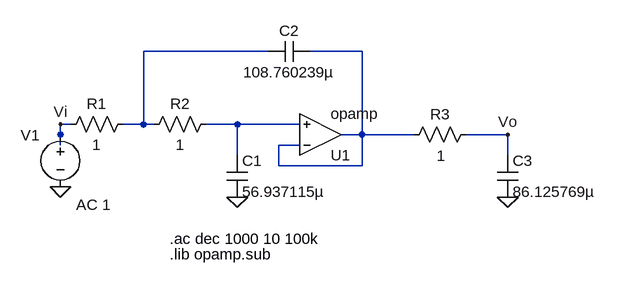
[diagram p0: schematic circuito simulación desnormalizado.asc]
circuito simulación desnormalizado.asc, the LTspice schematic file:
Version 4
SHEET 1 880 680
WIRE 160 16 -32 16
WIRE 304 16 224 16
WIRE -144 128 -160 128
WIRE -32 128 -32 16
WIRE -32 128 -64 128
WIRE -16 128 -32 128
WIRE 112 128 64 128
WIRE 208 128 112 128
WIRE -160 144 -160 128
WIRE 304 144 304 16
WIRE 304 144 272 144
WIRE 384 144 304 144
WIRE 528 144 464 144
WIRE -160 160 -160 144
WIRE 208 160 176 160
WIRE 112 176 112 128
WIRE 528 176 528 144
WIRE 176 192 176 160
WIRE 304 192 304 144
WIRE 304 192 176 192
FLAG -160 128 Vi
FLAG -160 224 0
FLAG 112 240 0
FLAG 528 240 0
FLAG 528 144 Vo
SYMBOL OpAmps\\opamp 240 208 M180
SYMATTR InstName U1
SYMBOL res -48 112 R90
WINDOW 0 0 56 VBottom 2
WINDOW 3 32 56 VTop 2
SYMATTR InstName R1
SYMATTR Value 1
SYMBOL res -32 144 R270
WINDOW 0 32 56 VTop 2
WINDOW 3 0 56 VBottom 2
SYMATTR InstName R2
SYMATTR Value 1
SYMBOL cap 96 176 R0
SYMATTR InstName C1
SYMATTR Value 56.937115µ
SYMBOL cap 224 0 R90
WINDOW 0 0 32 VBottom 2
WINDOW 3 32 32 VTop 2
SYMATTR InstName C2
SYMATTR Value 108.760239µ
SYMBOL voltage -160 128 R0
WINDOW 123 24 124 Left 2
WINDOW 39 0 0 Left 0
WINDOW 0 -61 17 Left 2
SYMATTR Value2 AC 1
SYMATTR InstName V1
SYMATTR Value ""
SYMBOL res 480 128 R90
WINDOW 0 0 56 VBottom 2
WINDOW 3 33 54 VTop 2
SYMATTR InstName R3
SYMATTR Value 1
SYMBOL cap 512 176 R0
SYMATTR InstName C3
SYMATTR Value 86.125769µ
TEXT 8 304 Left 2 !.ac dec 1000 10 100k
TEXT 8 328 Left 2 !.lib opamp.sub

The netlist it stands for:
* circuito simulación desnormalizado.asc
XU1 N002 N003 N002 opamp Aol=100K GBW=10Meg  ; pins invin noninvin out
R1 N001 Vi 1
R2 N001 N003 1
C1 N003 0 56.937115µ
C2 N002 N001 108.760239µ
V1 Vi 0 AC 1
R3 Vo N002 1
C3 Vo 0 86.125769µ
.ac dec 1000 10 100k
.lib opamp.sub
.backanno
.end